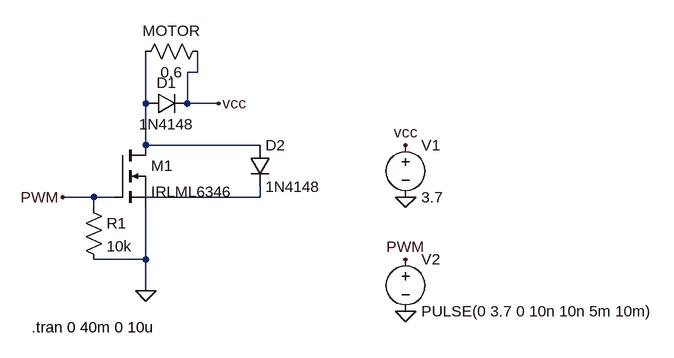
[diagram p0: schematic UNIDIRECTIONAL DRIVERS SIM.asc]
UNIDIRECTIONAL DRIVERS SIM.asc, the LTspice schematic file:
Version 4
SHEET 1 1024 680
WIRE 272 -16 272 -48
WIRE 272 -16 256 -16
WIRE 192 32 192 -48
WIRE 256 32 256 -16
WIRE 304 32 256 32
WIRE 192 96 192 32
WIRE 368 96 192 96
WIRE 112 176 64 176
WIRE 144 176 112 176
WIRE 368 176 368 160
WIRE 368 176 192 176
WIRE 112 192 112 176
WIRE 192 272 192 192
WIRE 192 272 112 272
WIRE 192 320 192 272
FLAG 592 96 vcc
FLAG 304 32 vcc
FLAG 592 272 PWM
FLAG 64 176 PWM
FLAG 592 176 0
FLAG 592 352 0
FLAG 192 320 0
SYMBOL nmos 144 96 R0
SYMATTR InstName M1
SYMATTR Value IRLML6346
SYMBOL res 96 176 R0
SYMATTR InstName R1
SYMATTR Value 10k
SYMBOL diode 192 48 R270
WINDOW 0 32 32 VTop 2
WINDOW 3 0 32 VBottom 2
SYMATTR InstName D1
SYMATTR Value 1N4148
SYMBOL voltage 592 80 R0
SYMATTR InstName V1
SYMATTR Value 3.7
SYMBOL voltage 592 256 R0
SYMATTR InstName V2
SYMATTR Value PULSE(0 3.7 0 10n 10n 5m 10m)
SYMBOL res 176 -32 R270
WINDOW 0 32 56 VTop 2
WINDOW 3 0 56 VBottom 2
SYMATTR InstName MOTOR
SYMATTR Value 0.6
SYMBOL diode 352 96 R0
SYMATTR InstName D2
SYMATTR Value 1N4148
TEXT 16 376 Left 2 !.tran 0 40m 0 10u

The netlist it stands for:
* UNIDIRECTIONAL DRIVERS SIM.asc
M1 N001 PWM 0 0 IRLML6346
R1 PWM 0 10k
D1 N001 vcc 1N4148
V1 vcc 0 3.7
V2 PWM 0 PULSE(0 3.7 0 10n 10n 5m 10m)
R§MOTOR N001 vcc 0.6
D2 N001 N002 1N4148
.model D D
.lib standard.dio
.model NMOS NMOS
.model PMOS PMOS
.lib standard.mos
.tran 0 40m 0 10u
.backanno
.end